# Altium schematic sheet Power_Regulation.SchDoc: Power
size A4; Author: Agni, Peter; SheetNumber: 2; SheetTotal: 9; SPICEModelCacheVIAWGOOX: <root> / <DocumentId>VIAWGOOX</DocumentId> / <CacheFrame Number="0"> / <Model Name="di_1n5819" Kind="MDL"> / <Text>*SRC=1N5819;DI_1N5819;Diodes;Si;  40.0V  1.00A  3.00us   Diodes Inc. Schottky Barrier Rectifier / .MODEL DI_1N5819 D  ( IS=390n RS=0.115 BV=40.0 IBV=1.00m / + CJO=203p  M=0.333 N=1.70 TT=4.32u )</Text> / </Model> / </CacheFrame> / </root>
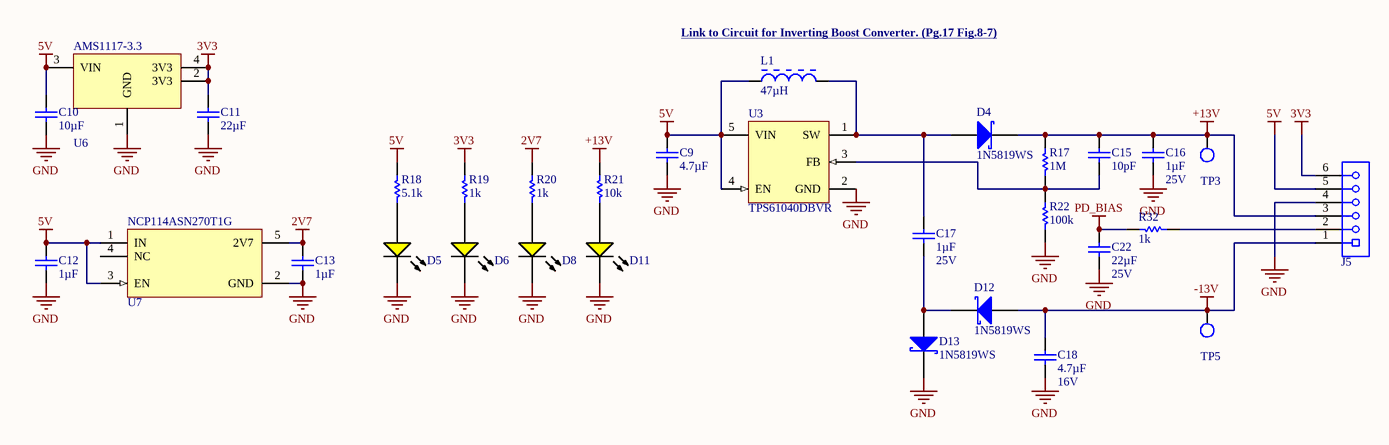
[diagram p0: Power_Regulation.SchDoc]

## Parts
C9  value 4.7µF  [CAPC1608X10N]  (hidden comment: CL10A475KO8NNNC)
C10  value 10µF  [CAPC1005X06N]  (hidden comment: CL05A106MQ5NUNC)
C11  value 22µF  [CAPC1608X10N]  (hidden comment: CL10A226MQ8NRNC)
C12  value 1µF  [CAPC1005X06N]  (hidden comment: CL05A105KA5NQNC)
C13  value 1µF  [CAPC1005X06N]  (hidden comment: CL05A105KA5NQNC)
C15  value 10pF  [CAPC1005X06N]  (hidden comment: CL05C100JB5NNNC)
C16  value 1µF  Voltage Rating: 25V  [CAPC1005X06N]  (hidden comment: CL05A105KA5NQNC)
C17  value 1µF  Voltage Rating: 25V  [CAPC1005X06N]  (hidden comment: CL05A105KA5NQNC)
C18  value 4.7µF  Voltage Rating: 16V  [CAPC1608X10N]  (hidden comment: CL10A475KO8NNNC)
C22  value 22µF  Voltage Rating: 25V  [CAPC2012X14N]  (hidden comment: CL21A226MAQNNNE)
D4  1N5819WS  [SODFL250X100-2N]
D5  KT-0805Y  [LED_0805]  (value not drawn)
D6  KT-0805Y  [LED_0805]  (value not drawn)
D8  KT-0805Y  [LED_0805]  (value not drawn)
D11  KT-0805Y  [LED_0805]  (value not drawn)
D12  1N5819WS  [SODFL250X100-2N]
D13  1N5819WS  [SODFL250X100-2N]
J5  68000-406HLF  [68000-406HLF-Footprint-1]  (value not drawn)
L1  value 47µH  [INDP5252X48L]  (hidden comment: PCD0504MT470)
R17  value 1M  [RESC1005X04N]  (hidden comment: 0402WGF1004TCE)
R18  value 5.1k  [RESC1005X04N]  (hidden comment: 0402WGF5101TCE)
R19  value 1k  [RESC1005X04N]  (hidden comment: CRCW04021K00FKEDC)
R20  value 1k  [RESC1005X04N]  (hidden comment: CRCW04021K00FKEDC)
R21  value 10k  [RESC1005X04N]  (hidden comment: CRCW0402-10K0FKED)
R22  value 100k  [RESC1005X04N]  (hidden comment: CRCW0402100KFKEDC)
R32  value 1k  [RESC1005X04N]  (hidden comment: CRCW04021K00FKEDC)
TP3  Test Point 5001  [FP-5001-MFG]  (value not drawn)
TP5  Test Point 5001  [FP-5001-MFG]  (value not drawn)
U3  TPS61040DBVR  [DBV0005A_L]
U6  AMS1117-3.3  [1117_REG_SOT223__SOT230P700X180-4L]
U7  NCP114ASN270T1G  [SOT95P280X110-5N]

## Nets
2V7: C13.2 R20.2 U7.5(2V7)
3V3: C11.2 J5.6 R19.2 U6.2(3V3) U6.4(3V3)
5V: C9.2 C10.2 C12.2 J5.5 L1.1 R18.2 U3.4(EN) U3.5(VIN) U6.3(VIN) U7.1(IN) U7.3(EN)
+13V: C15.2 C16.2 D4.1(K) J5.3 R17.1 R21.2 TP3.1
-13V: C18.2 D12.2(A) J5.1 TP5.1
GND: C9.1 C10.1 C11.1 C12.1 C13.1 C16.1 C18.1 C22.1 D5.1(K) D6.1(K) D8.1(K) D11.1(K) D13.1(K) J5.4 R22.2 U3.2(GND) U6.1(GND) U7.2(GND)
PD_BIAS: C22.2 R32.1
NetC15_1: C15.1 R17.2 R22.1 U3.3(FB)
NetC17_1: C17.1 D12.1(K) D13.2(A)
NetC17_2: C17.2 D4.2(A) L1.2 U3.1(SW)
NetD5_2: D5.2(A) R18.1
NetD6_2: D6.2(A) R19.1
NetD8_2: D8.2(A) R20.1
NetD11_2: D11.2(A) R21.1
NetJ5_2: J5.2 R32.2

Not connected (* = marked no-connect by the designer): U7 4(NC)

## Notes on the sheet
- (near L1) Link to Circuit for Inverting Boost Converter. (Pg.17 Fig.8-7) <https://www.ti.com/lit/ds/symlink/tps61041.pdf>
- Title:
- Designer:
- Date:
- Size:
- Revision:
- A4
- Sheet:
- 35 Stirling Hwy, Perth WA 6009, Australia

## Library data of the parts
C9 C18 = CMP-00044-4: 16V 4.7uF X5R ±10% 0603 Multilayer Ceramic Capacitors MLCC - SMD/SMT ROHS; Source: JLCPCB(Basic); JLC_PN: C19666; Case Code (Imperial): 0603; RoHS Compliant: Unsure; Tolerance: 10%; Dielectric: X5R
  C9: Voltage Rating: 16V
C10 = CMP-00663-2: Cap Ceramic 10uF 6.3V X5R 20% SMD 0402 85°C Paper T/R; Source: JLCPCB(Basic); JLC_PN: C15525; Tolerance: 20%; Case Code (Imperial): 0402; Voltage Rating: 6.3V; RoHS Compliant: Yes; Dielectric: X5R
C11 = CMP-00700-2: Multilayer Ceramic Capacitor, 22 uF, 6.3 V, ± 20%, X5R, 0603 [1608 Metric]; Voltage Rating: 6.3V; Source: JLCPCB(Basic); Dielectric: X5R; RoHS Compliant: Yes; JLC_PN: C59461; Case Code (Imperial): 0603; Tolerance: 20%
C12 C13 C16 C17 = CMP-00190-9: Ceramic Capacitor, Multilayer, Ceramic, 25V, 10% +Tol, 10% -Tol, X5R, 15% TC, 1uF, Surface Mount, 0402; JLC_PN: C52923; RoHS Compliant: Yes; Source: JLCPCB(Basic); Case Code (Imperial): 0402; Dielectric: X5R; Tolerance: 10%
  C12 C13: Voltage Rating: 25V
C15 = CMP-00653-3: Multilayer Ceramic Capacitor, 10 pF, 50 V, ± 5%, C0G (NP0), 0402 [1005 Metric]; Voltage Rating: 50V; Dielectric: C0G; JLC_PN: C32949; Source: JLCPCB(Basic); Case Code (Imperial): 0402; RoHS Compliant: Yes; Tolerance: 5%
C22 = CMP-00128-5: Ceramic Capacitor, Multilayer, Ceramic, 25V, 20% +Tol, 20% -Tol, X5R, 15% TC, 22uF, Surface Mount, 0805; RoHS Compliant: Yes; Case Code (Imperial): 0805; Source: JLCPCB(Basic); Dielectric: X5R; JLC_PN: C45783; Tolerance: 20%
D4 D12 D13 = CMP-00680-5: VR=40V IF=1A 120pF P=250mW; Forward Voltage: 600mV; Forward Current: 1A; Max Reverse Current: 500µA; Max Repetitive Reverse Voltage (Vrrm): 40V; Power Dissipation: 1.5W; Max Forward Surge Current (Ifsm): 25A; Technology: SCHOTTKY; Case/Package: SOD-323; JLC_PN: C191023; RoHS Compliant: Unsure; Source: JLCPCB(Basic)
D5 D6 D8 D11 = CMP-00852-3: Yellow 0805 LED Indication - Discrete ROHS; Forward Voltage: 2.2V; Luminous Intensity: 113mcd; Wavelength: 594nm; JLC_PN: C2296; RoHS Compliant: Unsure; Source: JLCPCB(Basic); Case Code (Imperial): 0805; Color: Yellow
J5 = CMP-00021-4: CONN HEADER 6POS .100 STR TIN; Pitch: 2.54mm; Current Rating: 3A; Connector Type: Male Pin; Gender: Male; Number of Contacts: 6; Insulation Resistance: 5G; Voltage Rating: 1.5kV; RoHS Compliant: Unsure; Min Operating Temperature: -65°C; Number of Rows: 1; Max Operating Temperature: 125°C; Orientation: Straight; Source: Aliexpress; Depth: 2.41mm; Contact Material: Bronze; Length: 15.24mm; Contact Plating: Tin; Housing Color: Black; Housing Material: Thermoplastic; Termination: Solder
L1 = CMP-00916-1: General Purpose Inductor, 47uH, 20%, 1 Element, SMD, 2320; Shielding: No; Core Material: Ferrite; Current Rating: 720mA; Test Frequency: 1kHz; Saturation Current: 1.1A; DC Resistance (DCR): 0.37; Tolerance: 20%; RoHS Compliant: Yes; Source: UWAA_Stock; Case Code (Imperial): N/A
R17 = CMP-00319-8: Fixed Resistor, Metal Glaze/thick Film, 0.0625W, 1000000ohm, 50V, 1% +/-Tol, 100ppm/Cel, Surface Mount, 0402; Power Rating: 62.5mW; Temperature Coefficient: -100100ppm/°C; JLC_PN: C26083; Case Code (Imperial): 0402; Tolerance: 1%; RoHS Compliant: Yes; Source: JLCPCB(Basic)
R18 = CMP-00657-3: RESISTOR, 0402 1% 5K1; Power Rating: 0.0625W; Resistance: 5.1kohm; Tolerance, Resistance: ± 1%; Series: MC;...; RoHS Compliant: Unsure; JLC_PN: C25905; Source: JLCPCB(Basic); Tolerance: 1%; Case Code (Imperial): 0402
R19 R20 R32 = CMP-00098-5: RES 1K OHM 1% 1/16W 0402; Power Rating: 62.5mW; Temperature Coefficient: 100ppm/°C; RoHS Compliant: Unsure; JLC_PN: C11702; Source: JLCPCB(Basic); Tolerance: 1%; Case Code (Imperial): 0402
R21 = CMP-00515-7: Res Thick Film 0402 10K Ohm 1% 1/16W ±100ppm/°C Molded SMD Paper T/R; Voltage Rating: 50V; Power Rating: 63mW; RoHS Compliant: Unsure; JLC_PN: C25744; Source: JLCPCB(Basic); Tolerance: 1%; Case Code (Imperial): 0402; Temperature Coefficient: 100ppm/°C
R22 = CMP-00094-5: RES 100K OHM 1% 1/16W 0402; Power Rating: 62.5mW; Temperature Coefficient: 100ppm/°C; Tolerance: 1%; Source: JLCPCB(Basic); JLC_PN: C25741; RoHS Compliant: Unsure; Case Code (Imperial): 0402
TP3 TP5 = CMP-001-0013-1: MS27478 - Connectors Receptacle Electrical Solder Mounting Solder Type Hermetic Seal 38999 Series II Test Point; Voltage Rating: 0V; Current Rating: 0A; Number of Contacts: 1; Contact Material: Silver; RoHS Compliant: Unsure; Housing Color: Black; Height: 4.72mm; Length: 7.62mm; Orientation: Straight; Termination: Through Hole; Gender: -; Mounting Technology: Through Hole; Number of Rows: 1; Source: UWAA_Stock; Contact Plating: Tin
U3 = CMP-00672-2: Conv DC-DC 1.8V to 6V Step Up Single-Out 1.8V to 28V 0.4A 5-Pin SOT-23 T/R; Quiescent Current: 28uA; Current Rating: 28mA; Number of Outputs: 1; Output Current per Channel: 350mA; Output Power: 357mW; Dimming: PWM; Topology: Boost; Output Current: 400mA; Efficiency: 86%; Operating Frequency: 1 MHz; Switching Frequency: 1MHz; Output Type: Adjustable; Max Supply Current: 50uA; Max Output current: 90mA; Radiation Hardening: No; Min Output Voltage: 1.8V; Weight: 0.000459oz; RoHS Compliant: Yes; Min Input Voltage: 1.8V; Number of Channels: 1; Min Supply Voltage: 1.8V; Width: 1.6mm; Series: -; Reach SVHC Compliant: No; Max Supply Voltage: 6V; Case/Package: SOT-23-5; Packaging: Tape and Reel; Thickness: 1.2mm; Output Voltage: 28V; Max Output Voltage: 28V; Package Quantity: 3000; JLC_PN: C7722; Max Operating Temperature: 85°C; Pins: 5; Min Operating Temperature: -40°C; Frequency: 1MHz; Termination: SMD/SMT; Lead Free: Lead Free; High Level Output Current: 90mA; Source: JLCPCB(Basic)
U6 = CMP-001-0007-3: Gull Wing EAR99 Fixed Positive Single Output Ldo Regulator Dual Voltage Regulator Linear 125C 1.2W 1A 1.8MM; Number of Outputs: 1; Nominal Supply Current: 5mA; Output Voltage: 3.3V; Dropout Voltage: 1.1V; Max Supply Voltage: 15V; Pins: 2; Height: 1.8mm; Max Power Dissipation: 1.2W; Max Operating Temperature: 125°C; Output Current: 1A; Min Operating Temperature: -40°C; JLC_PN: C6186; RoHS Compliant: Yes; Case/Package: SOT-223; Source: JLCPCB(Basic)
U7 = CMP-077-000020-1: LDO Voltage Regulator, Fixed, 1.7V to 5.5V, Single Output, 170mV, 2.7V, 300mA, 5 Pins, TSOP; Min Input Voltage: 3.2V; Max Power Dissipation: 250mW; Dropout Voltage: 135mV; Power Supply Rejection Ratio (PSRR): 40dB; Polarity: Positive; Accuracy: 1%; Number of Regulators: 1; Max Input Voltage: 5.5V; Min Output Voltage: 2.7V; Max Output Voltage: 2.7V; Output Voltage: 2.7V; RoHS Compliant: Unsure; Output Current: 300mA; Source: Distributor; RoHS: Compliant; Output Type: Fixed; Case/Package: SOT-23-5